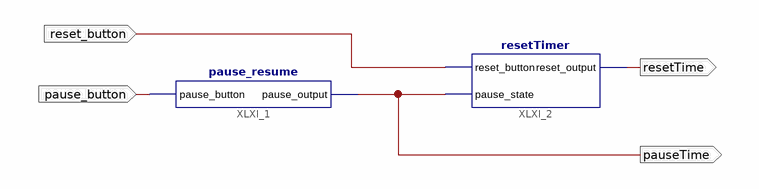
[diagram p0: schematic sheet 1]
// Xilinx ISE schematic controller.sch (spartan6) as structural Verilog: 2 symbols, 4 ports
module controller (
  input  pause_button,
  input  reset_button,
  output pauseTime,
  output resetTime
);

  pause_resume XLXI_1 (.pause_button(pause_button), .pause_output(pauseTime));
  resetTimer XLXI_2 (.reset_button(reset_button), .pause_state(pauseTime), .reset_output(resetTime));
endmodule
